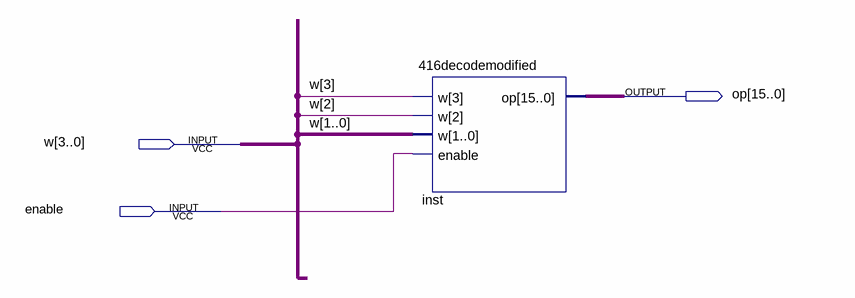
[diagram p0: schematic sheet]
// Quartus schematic 416decodemodified2.bdf as structural Verilog: 1 symbols, 3 pins
module \416decodemodified2  (
  input  [3:0] w,
  input  enable,
  output [15:0] op
);

  \416decodemodified  inst (.w(w), .enable(enable), .op(op));
endmodule
